# Altium schematic sheet LM317可调稳压输出模块.SchDoc
size A4
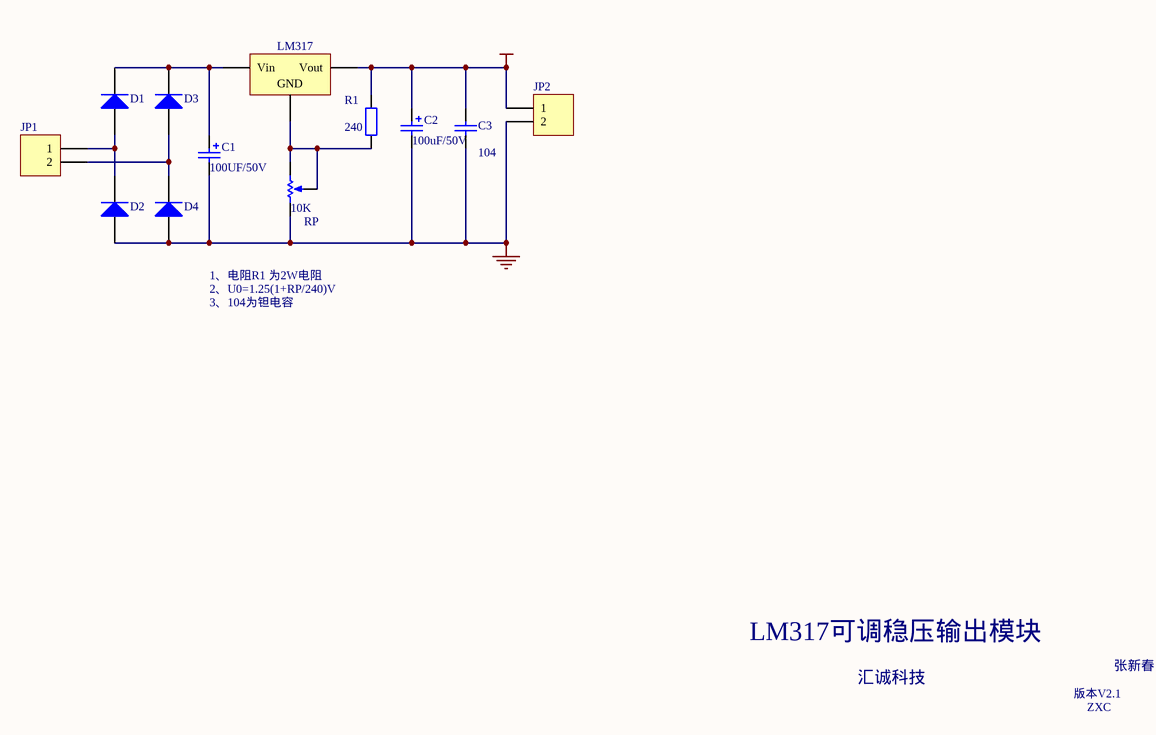
[diagram p0: LM317可调稳压输出模块.SchDoc]

## Parts
C1  value 100UF/50V  [C-DJ-6]  (hidden comment: DJDR)
C2  value 100uF/50V  [C-DJ-6]  (hidden comment: DJDR)
C3  value 104  [CPDR]  (hidden comment: CPDR)
D1  Diode 1N4007  [D-ZL-10]  (value not drawn)
D2  Diode 1N4007  [D-ZL-10]  (value not drawn)
D3  Diode 1N4007  [D-ZL-10]  (value not drawn)
D4  Diode 1N4007  [D-ZL-10]  (value not drawn)
JP1  PZ_2  [JIKEKE]  (value not drawn)
JP2  PZ_2  [JIKEKE]  (value not drawn)
LM317  SDWYG  [wyk]  (value not drawn)
R1  value 240  [ZCDZL]  (hidden comment: Res)
RP  value 10K  [SIP3-D]  (hidden comment: RPot)

## Nets
GND: C1.2 C2.2 C3.1 D2.1(A) D4.1(A) JP2.2 RP.1(TOP)
VCC: C2.1 C3.2 JP2.1 LM317.2(Vout) R1.2
NetC1_1: C1.1 D1.2(K) D3.2(K) LM317.3(Vin)
NetD1_1: D1.1(A) D2.2(K) JP1.1
NetD3_1: D3.1(A) D4.2(K) JP1.2
NetLM317_1: LM317.1(AD) R1.1 RP.2(BOT) RP.3(TAP)

## Notes on the sheet
- 1、电阻R1 为2W电阻
- 2、U0=1.25(1+RP/240)V
- 3、104为钽电容
- LM317可调稳压输出模块
- 汇诚科技
- 版本V2.1
- 张新春
- ZXC
- (in symbol SDWYG) GND

## Library data of the parts
C1 C2 = DJDR: 电解电容; Published: 8-Jun-2000; LatestRevisionDate: 17-Jul-2002; LatestRevisionNote: Re-released for DXP Platform.; Publisher: Altium Limited
C3 = CPDR: 瓷片电容; Published: 8-Jun-2000; LatestRevisionDate: 17-Jul-2002; LatestRevisionNote: Re-released for DXP Platform.; Publisher: Altium Limited
D1-D4 = Diode 1N4007: 1 Amp General Purpose Rectifier; Published: 8-Jun-2000; LatestRevisionDate: 17-Jul-2002; LatestRevisionNote: Re-released for DXP Platform.; DatasheetDocument: 1998; PackageDocument: Aug-1999; PackageReference: DO-41; Publisher: Altium Limited; Code_JEDEC: DO-204-AL
JP1 JP2 = PZ_2: 排针——2; LatestRevisionDate: 17-Jul-2002; LatestRevisionNote: Re-released for DXP Platform.; Publisher: Altium Limited
LM317 = SDWYG: 三端稳压器; Published: 24-Mar-1999; LatestRevisionDate: 17-Jul-2002; LatestRevisionNote: Re-released for DXP Platform.; Publisher: Altium Limited; Code_JEDEC: SMD-220
R1 = Res: 电阻; Published: 8-Jun-2000; LatestRevisionDate: 17-Jul-2002; LatestRevisionNote: Re-released for DXP Platform.; Publisher: Altium Limited
RP = RPot: Potentiometer; Sim Note: Enter the Resistance value and the set point into parameter fields.; Set Position: 0.5; Published: 8-Jun-2000; LatestRevisionDate: 17-Jul-2002; LatestRevisionNote: Re-released for DXP Platform.; Publisher: Altium Limited